# Altium project USB-GPIB.PrjPcb
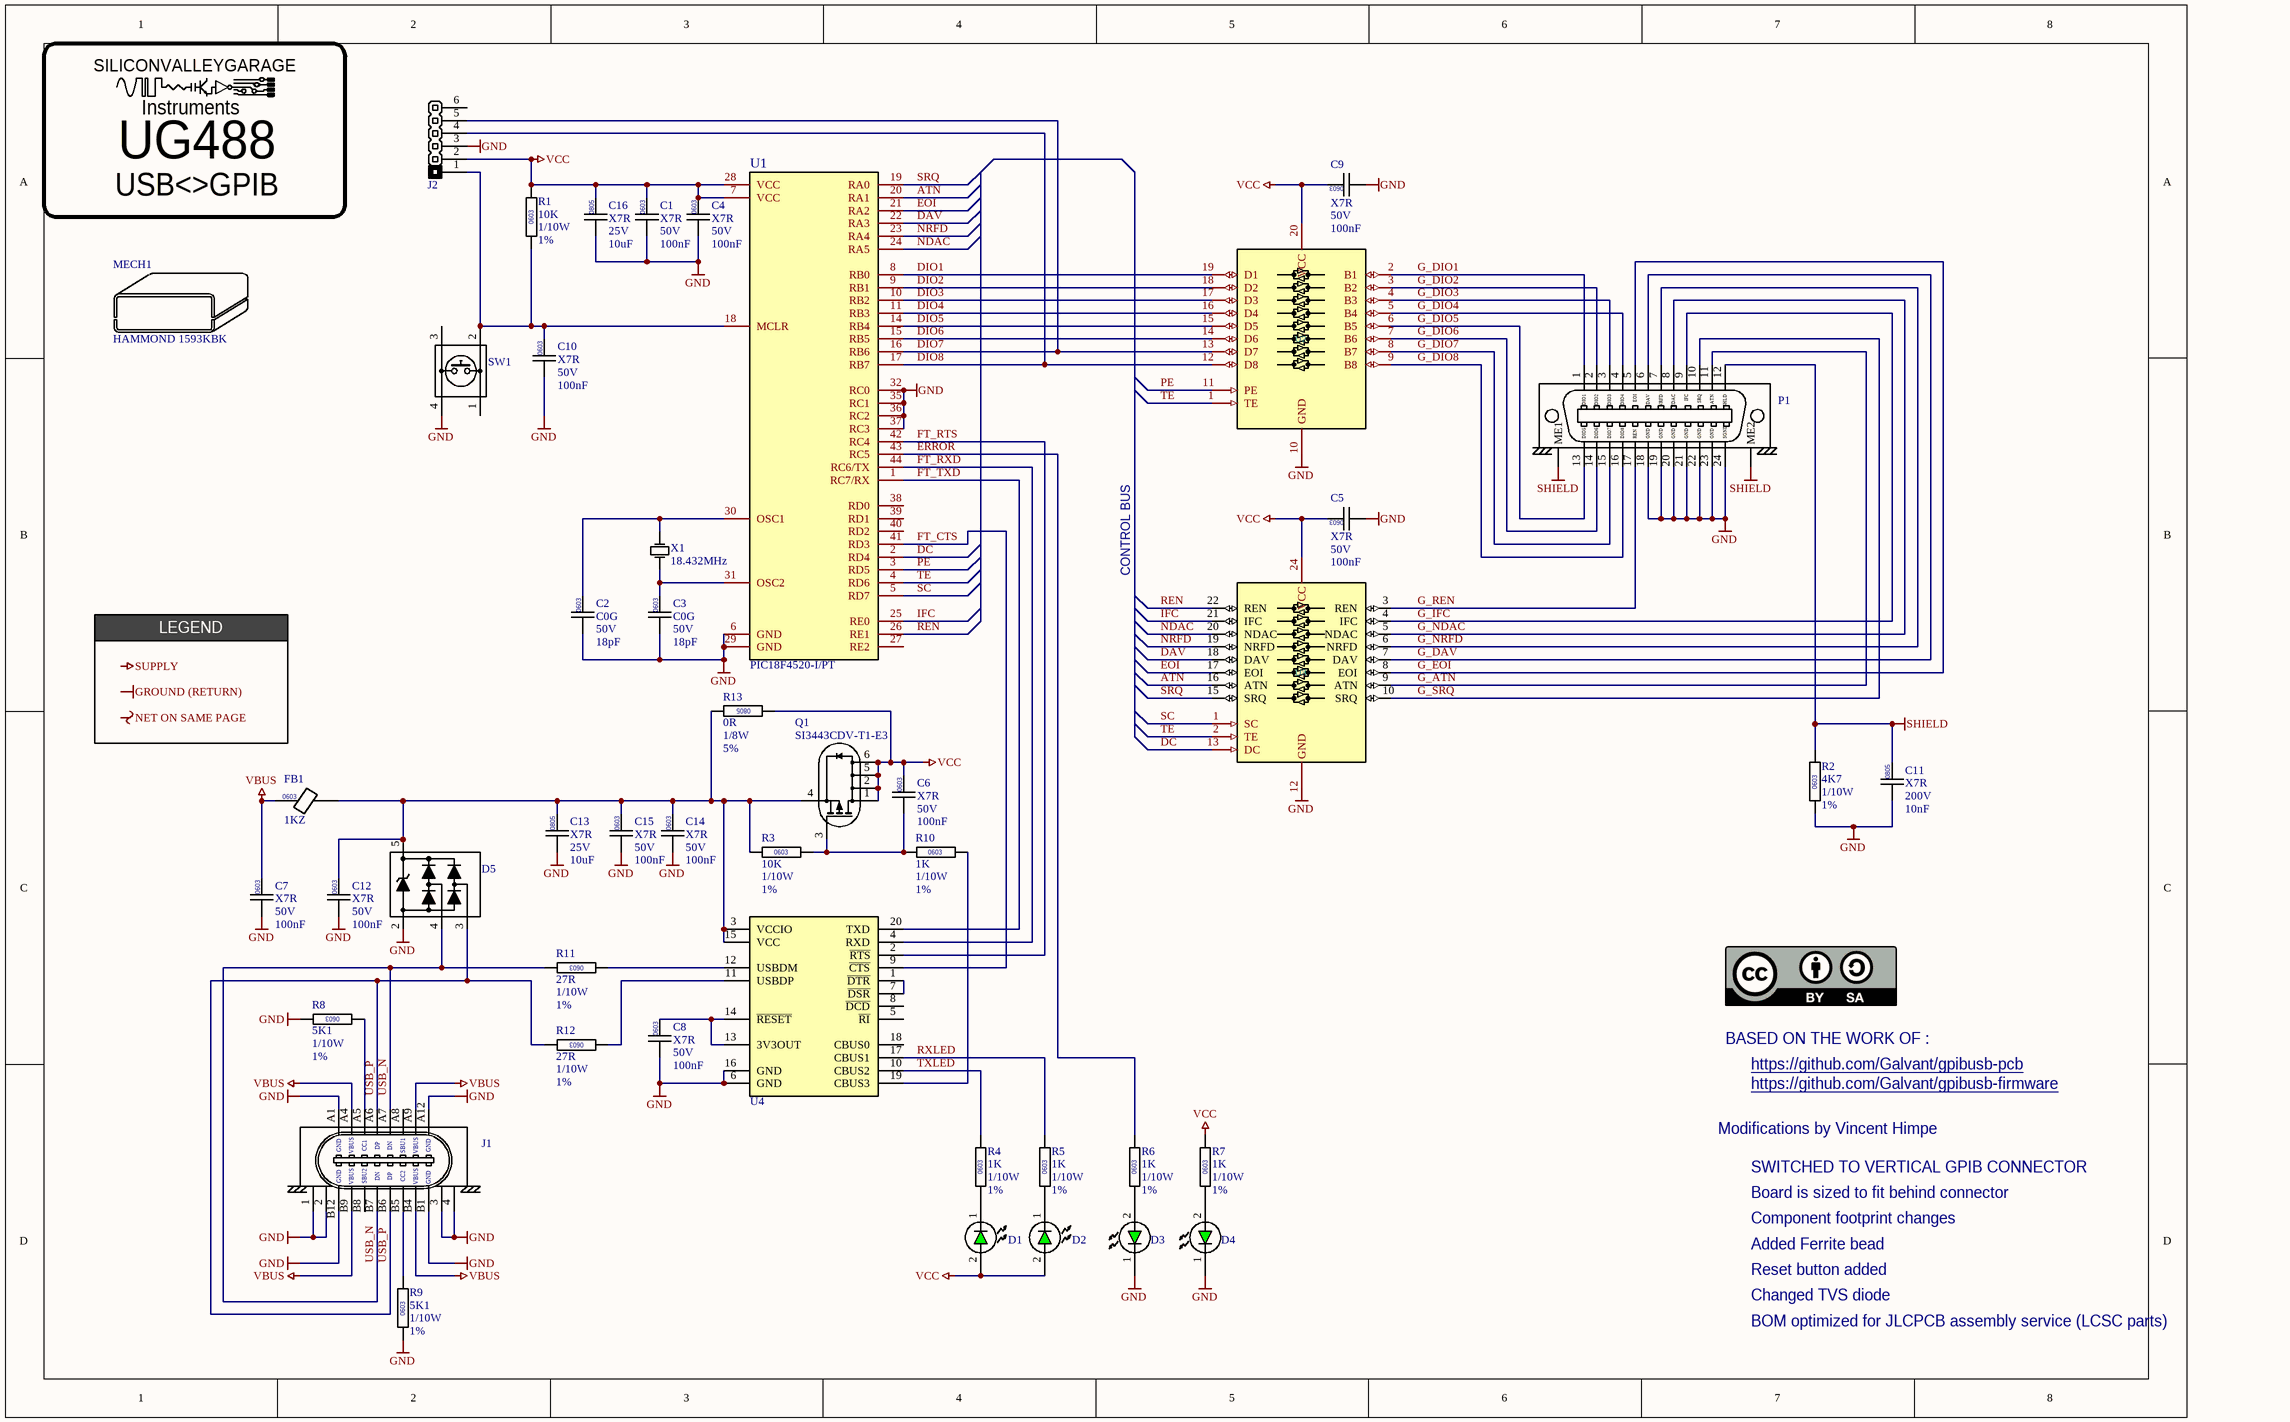
[diagram p0: USB-GPIB-HAMMOND.SchDoc]
SCHdrafter: Vincent Himpe
1 sheet, 47 parts. Net scope: global (net labels, ports and power ports of the same name join across sheets).
Board files: USB-GPIB-hammond.PcbDoc, USB-GPIB-SIDEPANEL.PcbDoc

## Sheet USB-GPIB-HAMMOND.SchDoc
size Tabloid; ENG_APP_DATE: --/--/--; DSN_APP_DATE: --/--/--; CHK_APP_DATE: --/--/--

### Parts
C1  Dielectric: X7R  Voltage: 50V  Capacitance: 100nF  [CAPC0603]  (hidden comment: CAP0603)
C2  Dielectric: C0G  Voltage: 50V  Capacitance: 18pF  [CAPC0603]  (hidden comment: CAP0603)
C3  Dielectric: C0G  Voltage: 50V  Capacitance: 18pF  [CAPC0603]  (hidden comment: CAP0603)
C4  Dielectric: X7R  Voltage: 50V  Capacitance: 100nF  [CAPC0603]  (hidden comment: CAP0603)
C5  Dielectric: X7R  Voltage: 50V  Capacitance: 100nF  [CAPC0603]  (hidden comment: CAP0603)
C6  Dielectric: X7R  Voltage: 50V  Capacitance: 100nF  [CAPC0603]  (hidden comment: CAP0603)
C7  Dielectric: X7R  Voltage: 50V  Capacitance: 100nF  [CAPC0603]  (hidden comment: CAP0603)
C8  Dielectric: X7R  Voltage: 50V  Capacitance: 100nF  [CAPC0603]  (hidden comment: CAP0603)
C9  Dielectric: X7R  Voltage: 50V  Capacitance: 100nF  [CAPC0603]  (hidden comment: CAP0603)
C10  Dielectric: X7R  Voltage: 50V  Capacitance: 100nF  [CAPC0603]  (hidden comment: CAP0603)
C11  Dielectric: X7R  Voltage: 200V  Capacitance: 10nF  [CAPC0805]  (hidden comment: CAP0805)
C12  Dielectric: X7R  Voltage: 50V  Capacitance: 100nF  [CAPC0603]  (hidden comment: CAP0603)
C13  Dielectric: X7R  Voltage: 25V  Capacitance: 10uF  [CAPC0805]  (hidden comment: CAP0805)
C14  Dielectric: X7R  Voltage: 50V  Capacitance: 100nF  [CAPC0603]  (hidden comment: CAP0603)
C15  Dielectric: X7R  Voltage: 50V  Capacitance: 100nF  [CAPC0603]  (hidden comment: CAP0603)
C16  Dielectric: X7R  Voltage: 25V  Capacitance: 10uF  [CAPC0805]  (hidden comment: CAP0805)
D1  LED-3MM-GREEN  [LED-3MM-GREEN]  (value not drawn)
D2  LED-3MM-GREEN  [LED-3MM-GREEN]  (value not drawn)
D3  LED-3MM-GREEN  [LED-3MM-GREEN]  (value not drawn)
D4  LED-3MM-GREEN  [LED-3MM-GREEN]  (value not drawn)
D5  TVS-WURTH-824011  [SOT23-5]  (value not drawn)
FB1  value 1KZ  [FB0603]  (hidden comment: FB0603)
J1  CONN-USBC-USB2-HOR  [CONN-GCT-USB4085]  (value not drawn)
J2  CONN-HEADER-PIN-1X6  [HEADER-1X6]  (value not drawn)
LOGO?  LOGO-SILICONVALLEYGARAGE-SMALL  [SILICONVALLEYGARAGE]  (value not drawn)  (graphical)
MECH1  HAMMOND 1593KBK  (mechanical)
P1  CONN-NORCOMP-112-024-113R001  [CONN-NORCOMP-112-024-113R001]  (value not drawn)
Q1  Manufacturer Part Number 1: SI3443CDV-T1-E3  [SOT23-6]  (hidden comment: SI3443)
R1  value 10K  Power: 1/10W  Tolerance: 1%  [RESC0603]  (hidden comment: RESC0603)
R2  value 4K7  Power: 1/10W  Tolerance: 1%  [RESC0603]  (hidden comment: RESC0603)
R3  value 10K  Power: 1/10W  Tolerance: 1%  [RESC0603]  (hidden comment: RESC0603)
R4  value 1K  Power: 1/10W  Tolerance: 1%  [RESC0603]  (hidden comment: RESC0603)
R5  value 1K  Power: 1/10W  Tolerance: 1%  [RESC0603]  (hidden comment: RESC0603)
R6  value 1K  Power: 1/10W  Tolerance: 1%  [RESC0603]  (hidden comment: RESC0603)
R7  value 1K  Power: 1/10W  Tolerance: 1%  [RESC0603]  (hidden comment: RESC0603)
R8  value 5K1  Power: 1/10W  Tolerance: 1%  [RESC0603]  (hidden comment: RESC0603)
R9  value 5K1  Power: 1/10W  Tolerance: 1%  [RESC0603]  (hidden comment: RESC0603)
R10  value 1K  Power: 1/10W  Tolerance: 1%  [RESC0603]  (hidden comment: RESC0603)
R11  value 27R  Power: 1/10W  Tolerance: 1%  [RESC0603]  (hidden comment: RESC0603)
R12  value 27R  Power: 1/10W  Tolerance: 1%  [RESC0603]  (hidden comment: RESC0603)
R13  value 0R  Power: 1/8W  Tolerance: 5%  [RESC0805]  (hidden comment: RESC0805)
SW1  SWITCH-PANASONIC-EVP-AA202K  [SWITCH-PANASONIC-EVP-AA202K]  (value not drawn)
U1  Manufacturer Part Number 1: PIC18F4520-I/PT  [QFP80P1200X1200-44N]  (hidden comment: PIC18F4520)
U2  SN75160B  [SO127P1030-20N]  (value not drawn)
U3  SN75162B  [SO127P1030-24N]  (value not drawn)
U4  IC-FTDI-FT231XS-R  [SO65P640X110-20N]  (value not drawn)
X1  Frequency: 18.432MHz  [XTAL-ABRACON-ABM3]  (hidden comment: CRYSTAL-2PIN)

### Blocks framed on the sheet
UG488: LOGO?

### Nets
GND: C1.2 C2.2 C3.2 C4.2 C5.2 C7.2 C8.2 C9.2 C10.2 C11.2 C12.2 C13.2 C14.2 C15.2 C16.2 D3.1(A) D4.1(A) D5.2(A) J1.1 J1.2 J1.3 J1.4 J1.A1 J1.A12 J1.B1 J1.B12 J2.3(+) P1.18(GND) P1.19(GND) P1.20(GND) P1.21(GND) P1.22(GND) P1.23(GND) P1.24(SGND) R2.2 R8.1 R9.2 SW1.4 U1.6(GND) U1.29(GND) U1.32(RC0) U1.35(RC1) U1.36(RC2) U1.37(RC3) U2.10(GND) U3.12(GND) U4.6(GND) U4.16(GND)
SHIELD: C11.1 P1.12(SHLD) P1.ME1 P1.ME2 R2.1
VBUS: C7.1 FB1.1 J1.A4 J1.A9 J1.B4 J1.B9
VCC: C1.1 C4.1 C5.1 C6.1 C9.1 C16.1 D1.2(K) D2.2(K) J2.2(+) Q1.1(D) Q1.2(D) Q1.5(D) Q1.6(D) R1.1 R7.1 R13.2 U1.7(VCC) U1.28(VCC) U2.20(VCC) U3.24(VCC)
ATN: U1.20(RA1) U3.16(ATN)
DAV: U1.22(RA3) U3.18(DAV)
DC: U1.2(RD4) U3.13(DC)
DIO1: U1.8(RB0) U2.19(D1)
DIO2: U1.9(RB1) U2.18(D2)
DIO3: U1.10(RB2) U2.17(D3)
DIO4: U1.11(RB3) U2.16(D4)
DIO5: U1.14(RB4) U2.15(D5)
DIO6: U1.15(RB5) U2.14(D6)
DIO7: J2.5(+) U1.16(RB6) U2.13(D7)
DIO8: J2.4(+) U1.17(RB7) U2.12(D8)
EOI: U1.21(RA2) U3.17(EOI)
ERROR: R6.1 U1.43(RC5)
FT_CTS: U1.41(RD3) U4.9(~{CTS})
FT_RTS: U1.42(RC4) U4.2(~{RTS})
FT_RXD: U1.44(RC6/TX) U4.4(RXD)
FT_TXD: U1.1(RC7/RX) U4.20(TXD)
G_ATN: P1.11(ATN) U3.9(ATN)
G_DAV: P1.6(DAV) U3.7(DAV)
G_DIO1: P1.1(DIO1) U2.2(B1)
G_DIO2: P1.2(DIO2) U2.3(B2)
G_DIO3: P1.3(DIO3) U2.4(B3)
G_DIO4: P1.4(DIO4) U2.5(B4)
G_DIO5: P1.13(DIO5) U2.6(B5)
G_DIO6: P1.14(DIO6) U2.7(B6)
G_DIO7: P1.15(DIO7) U2.8(B7)
G_DIO8: P1.16(DIO8) U2.9(B8)
G_EOI: P1.5(EOI) U3.8(EOI)
G_IFC: P1.9(IFC) U3.4(IFC)
G_NDAC: P1.8(NDAC) U3.5(NDAC)
G_NRFD: P1.7(NRFD) U3.6(NRFD)
G_REN: P1.17(REN) U3.3(REN)
G_SRQ: P1.10(SRQ) U3.10(SRQ)
IFC: U1.25(RE0) U3.21(IFC)
NDAC: U1.24(RA5) U3.20(NDAC)
NRFD: U1.23(RA4) U3.19(NRFD)
PE: U1.3(RD5) U2.11(PE)
REN: U1.26(RE1) U3.22(REN)
RXLED: R5.1 U4.17(CBUS1)
SC: U1.5(RD7) U3.1(SC)
SRQ: U1.19(RA0) U3.15(SRQ)
TE: U1.4(RD6) U2.1(TE) U3.2(TE)
TXLED: R4.1 U4.10(CBUS2)
USB_N: D5.4(A) J1.A7 J1.B7 R11.1
USB_P: D5.3(A) J1.A6 J1.B6 R12.1
NetC2_1: C2.1 U1.30(OSC1) X1.1(OSC1)
NetC3_1: C3.1 U1.31(OSC2) X1.2(OSC2)
NetC6_2: C6.2 Q1.3(G1) R3.1 R10.2
NetC8_1: C8.1 U4.13(3V3OUT) U4.14(~{RESET})
NetC10_1: C10.1 J2.1(+) R1.2 SW1.2 U1.18(MCLR)
NetC12_1: C12.1 C13.1 C14.1 C15.1 D5.5(A) FB1.2 Q1.4(S) R3.2 R13.1 U4.3(VCCIO) U4.15(VCC)
NetD1_1: D1.1(A) R4.2
NetD2_1: D2.1(A) R5.2
NetD3_2: D3.2(K) R6.2
NetD4_2: D4.2(K) R7.2
NetJ1_A5: J1.A5 R8.2
NetJ1_B5: J1.B5 R9.1
NetR10_1: R10.1 U4.19(CBUS3)
NetR11_2: R11.2 U4.12(USBDM)
NetR12_2: R12.2 U4.11(USBDP)
NetU4_1: U4.1(~{DTR}) U4.7(~{DSR})

Not connected (* = marked no-connect by the designer): J1 A8 B8; J2 6(+); SW1 1 3; U1 27(RE2) 38(RD0) 39(RD1) 40(RD2); U4 5(~{RI}) 8(~{DCD}) 18(CBUS0)

### Notes on the sheet
- (near LOGO?) Instruments
- USB<>GPIB
- CONTROL BUS
- LEGEND
- BASED ON THE WORK OF :
- https://github.com/Galvant/gpibusb-pcb
- https://github.com/Galvant/gpibusb-firmware
- SWITCHED TO VERTICAL GPIB CONNECTOR
- Board is sized to fit behind connector
- Modifications by Vincent Himpe
- Component footprint changes
- Added Ferrite bead
- Reset button added
- Changed TVS diode
- BOM optimized for JLCPCB assembly service (LCSC parts)
- Labels drawn without touching a wire or pin: GROUND (RETURN), NET ON SAME PAGE, SUPPLY
- DWG. NO.
- REV.
- SHT.
- THIS DOCUMENT AND THE DATA DISCLOSED HEREIN OR HEREWITH IS THE PROPERTY OF ALTIUM LIMITED AND MAY BE FREELY DISTRIBUTED IN WHOLE. NO RIGHTS ARE RESERVED OR EXPRESS OR IMPLIED WARANTEE GIVEN.
- REVISION
- DESCRIPTION
- DATE
- APPROVED
- ENG:
- APPROVALS
- PROJECT
- DSN:
- CHK:
- REFERENCE DOCUMENTS
- PROJECT REVISION:
- TITLE
- DOCUMENT REVISION:
- DESIGN ITEM:
- BOM:
- FAB DWG:
- PCB DWG:
- ASSY DWG:
- SCALE:
- SIZE
- B
- CAGE CODE
- FILE NAME
- DWG NO.
- SHEET
- OF
- REV
- (in symbol CAPC-0805-10nF-200V-ESD) 0805
- (in symbol CAPC-0805-10uF-25V) 0805
- (in symbol CONN-USBC-USB2-HOR) GND; VBUS; CC1; DP; DN; SBU1; SBU2; CC2
- (in symbol FB0603-1KZ-0R2) 0603
- (in symbol LOGO-SILICONVALLEYGARAGE-SMALL) SILICONVALLEYGARAGE
- (in symbol RESC-0603-1K-1%-1/10W) 0603
- (in symbol RESC-0603-4K7-1%-1/10W) 0603
- (in symbol RESC-0603-5K1-1%-1/10W) 0603
- (in symbol RESC-0603-10K-1%-1/10W) 0603
- (in symbol RESC-0603-27R-1%-1/10W) 0603
- (in symbol RESC-0805-0R-JUMPER) 0805

### Library data of the parts
C1 C4-C10 C12 C14 C15 = CAPC-0603-100nF-50V-X7R: CAPACITOR,CERAMIC,100nF,50V,X7R,0603; Manufacturer 1: KEMET; Manufacturer Part Number 1: C0603C104K5RACTU; Package / Case: 0603; Location: *; Supplier 1: Mouser; Supplier Part Number 1: 80-C0603C104K5R7867; Supplier 2: Mouser; Supplier Part Number 2: 80-C0603C104K5R7411; Supplier 3: Avnet; Supplier Part Number 3: KGM15BR71H104KT; Supplier 4: Digikey; Supplier Part Number 4: 1276-1000-1-ND; LCSC: C127833; MOUSER: 80-C0603C104K5R
C2 C3 = CAPC-0603-18PF-50V-C0G: CAPACITOR,CERAMIC,18pF,50V,C0G,0603; Manufacturer 1: KEMET; Manufacturer Part Number 1: C0603C180K5GACTU; Package / Case: 0603; Location: *; LCSC: C2169518; MOUSER: 80-C0603C180K5G
C11 = CAPC-0805-10nF-200V-ESD: CAPACITOR,CERAMIC,10nF,200V,X7R,0805,ESD; Manufacturer 1: KEMET; Manufacturer Part Number 1: C0805C103K2RECAUTO; Package / Case: 0805 (2012 metric); Location: *; LCSC: C36911368; Supplier 1: Mouser; Supplier Part Number 1: 80-C0805C103K2RECAUT; MOUSER: 80-C0805C103K2RECAUT
C13 C16 = CAPC-0805-10uF-25V: CAPACITOR,CERAMIC,10uF,25V,X5R,0805; Manufacturer 1: SAMSUNG; Manufacturer Part Number 1: CL21B106KAYQNNE; Package / Case: 0805 (2012 metric); Location: *; LCSC: C3039694; MOUSER: 187-CL21B106KAYQNNE
D1-D4 = LED-3MM-GREEN: LED,TH,GREEN,42mCd,3MM; Manufacturer 1: WURTH; Manufacturer Part Number 1: 151031VS06000; MOUSER: 78-VLMPG33N1P2; Supplier 1: Mouser; Supplier Part Number 1: 78-VLMPG33N1P2
D5 = TVS-WURTH-824011: DIODE,TVS,DUAL,UNIDIRECTIONAL,USB; Manufacturer 1: WURTH; Manufacturer Part Number 1: 824011; Supplier 1: Digikey; Supplier Part Number 1: 732-4465-1-ND; LCSC: C22358704; DIGIKEY: 732-4465-1-ND; MOUSER: 710-824011
FB1 = FB0603-1KZ-0R2: FERRITE,1KZ@100MHz,0R2DC,0603; Manufacturer 1: MURATA; Manufacturer Part Number 1: BLM18KG102SN1D; LCSC: C160982; Supplier 1: Arrow Electronics; Supplier Part Number 1: BLM18KG102SN1D; MOUSER: 81-BLM18KG102SN1D
J1 = CONN-USBC-USB2-HOR: CONN,USB-C,16P,RA,TH,8.94X9.17; Manufacturer 1: GCT; Manufacturer Part Number 1: USB4085-GF-A; Supplier 1: Digikey; Supplier Part Number 1: 2073-USB4085-GF-ACT-ND; LCSC: C7095263; MOUSER: 640-USB4085-GF-A
LOGO? = LOGO-SILICONVALLEYGARAGE-SMALL: LOGO,SILICONVALLEYGARAGE,SMALL
MECH1 = MECH-HAMMOND-1593KBK: ENCLOSURE,ABS,GRAY,HAMMOND, 1593KBK; DIGIKEY: HM355-ND; MOUSER: 546-1593KBK; Manufacturer 1: HAMMOND; Manufacturer Part Number 1: 1593KBK
P1 = CONN-NORCOMP-112-024-113R001: CONN,GPIB,24P,RIGHT ANGLE,TH; Supplier 1: Digikey; Supplier Part Number 1: 1024RMA-ND; Manufacturer 1: NORCOMP; Manufacturer Part Number 1: 112-024-113R001; MOUSER: 636-112-024-113R001
Q1 = XSTR-VISHAY-SI3443CDV-T1-E3: XSTR,PMOS,20V,5.97A,VISHAY,SI3443,SOT26; DIGIKEY: SI3443CDV-T1-GE3; LCSC: C727385; Manufacturer 1: VISHAY; MOUSER: 781-SI3443CDV-GE3
R1 R3 = RESC-0603-10K-1%-1/10W: RESISTOR,10K,1%,100mW,0603 (1608); Manufacturer 1: YAGEO; Manufacturer Part Number 1: RC0603FR-0710KL; Location: *; Supplier 1: Future Electronics; Supplier Part Number 1: 4023214; Supplier 2: Digikey; Supplier Part Number 2: RMCF0603FT10K0CT-ND; Supplier 3: Mouser; Supplier Part Number 3: 667-ERJ-3EKF1002V; LCSC: C98220; MOUSER: 603-RC0603FR-0710KL
R2 = RESC-0603-4K7-1%-1/10W: RESISTOR,4K7,1%,100mW,0603 (1608); Manufacturer 1: YAGEO; Manufacturer Part Number 1: RC0603FR-074K7L; Location: *; Supplier 1: Future Electronics; Supplier Part Number 1: 5489695; Supplier 2: Digikey; Supplier Part Number 2: P4.70KHCT-ND; Supplier 3: Digikey; Supplier Part Number 3: RMCF0603FT4K70CT-ND; Supplier 4: Avnet; Supplier Part Number 4: 1622960-1; LCSC: C99782; MOUSER: 603-RC0603FR-074K7L
R4-R7 R10 = RESC-0603-1K-1%-1/10W: RESISTOR,1K,1%,100mW,0603 (1608); Manufacturer 1: YAGEO; Manufacturer Part Number 1: RC0603FR-071KL; Location: *; LCSC: C22548; MOUSER: 603-RC0603FR-071KL
R8 R9 = RESC-0603-5K1-1%-1/10W: RESISTOR,5K1,1%,100mW,0603 (1608); Manufacturer 1: YAGEO; Manufacturer Part Number 1: RC0603FR-075K1L; Location: *; LCSC: C105580; MOUSER: 603-RC0603FR-075K1
R11 R12 = RESC-0603-27R-1%-1/10W: RESISTOR,27R,1%,100mW,0603 (1608); Manufacturer 1: YAGEO; Manufacturer Part Number 1: RC0603FR-0727RL; Location: *; LCSC: C137753; MOUSER: 603-RC0603FR-0727RL
R13 = RESC-0805-0R-JUMPER: RESISTOR,0R,JUMPER; Manufacturer 1: YAGEO; Manufacturer Part Number 1: RC0805JR-070RL; Location: *; Parameter 4: *; LCSC: C96345; MOUSER: 603-RC0805JR-070RL
SW1 = SWITCH-PANASONIC-EVP-AA202K: SW,SMD,TACT,4PIN,2.9X3.5,4PIN; Supplier 1: Mouser; Supplier Part Number 1: 667-EVP-AA202K; LCSC: C483888; DIGIKEY: EVP-AA202K; MOUSER: 667-EVP-AA202K
U1 = IC-MICROCHIP-PIC18F4520: IC,CPU,MICROCHIP,PIC18F4520,TQFP44; Parameter 1: *; LCSC: C9734; Manufacturer 1: MICROCHIP; MOUSER: 579-PIC18F4520-I/PT
U2 = IC-TI-SN75160B: IC,XCVR,GPIB,DATA.TI,SN75160DW,SO20W; Manufacturer 1: TI; Manufacturer Part Number 1: SN75160BDWR; MOUSER: 595-SN75160BDW; LCSC: C882412
U3 = IC-TI-SN75162B: IC,XCVR,GPIB,CONTROL,TI,SN75162DW,SO24W; Manufacturer Part Number 1: SN75162BDW; LCSC: C2863933; DIGIKEY: *; MOUSER: 595-SN75162BDWR; Manufacturer 1: TI
U4 = IC-FTDI-FT231XS-R: IC,XCVR,USB UART,FTDI,FT231XS-R,TSSOP20; LCSC: C132160; Manufacturer 1: FTDI; MOUSER: 895-FT231XS-R; Manufacturer Part Number 1: FT231XS-R
X1 = XTAL-ABRACON-ABM3-18.432MHZ-D2Y-T: XTAL,18.432MHz,ABRACON ABM3,SMD5032; LCSC: C1985331; Manufacturer 1: ABRACON; Manufacturer Part Number 1: ABM3-18.432MHZ-D2Y-T; MOUSER: 815-ABM3-18.43-D2Y-T